# Altium schematic sheet DDR4 Slot.SchDoc
size A3
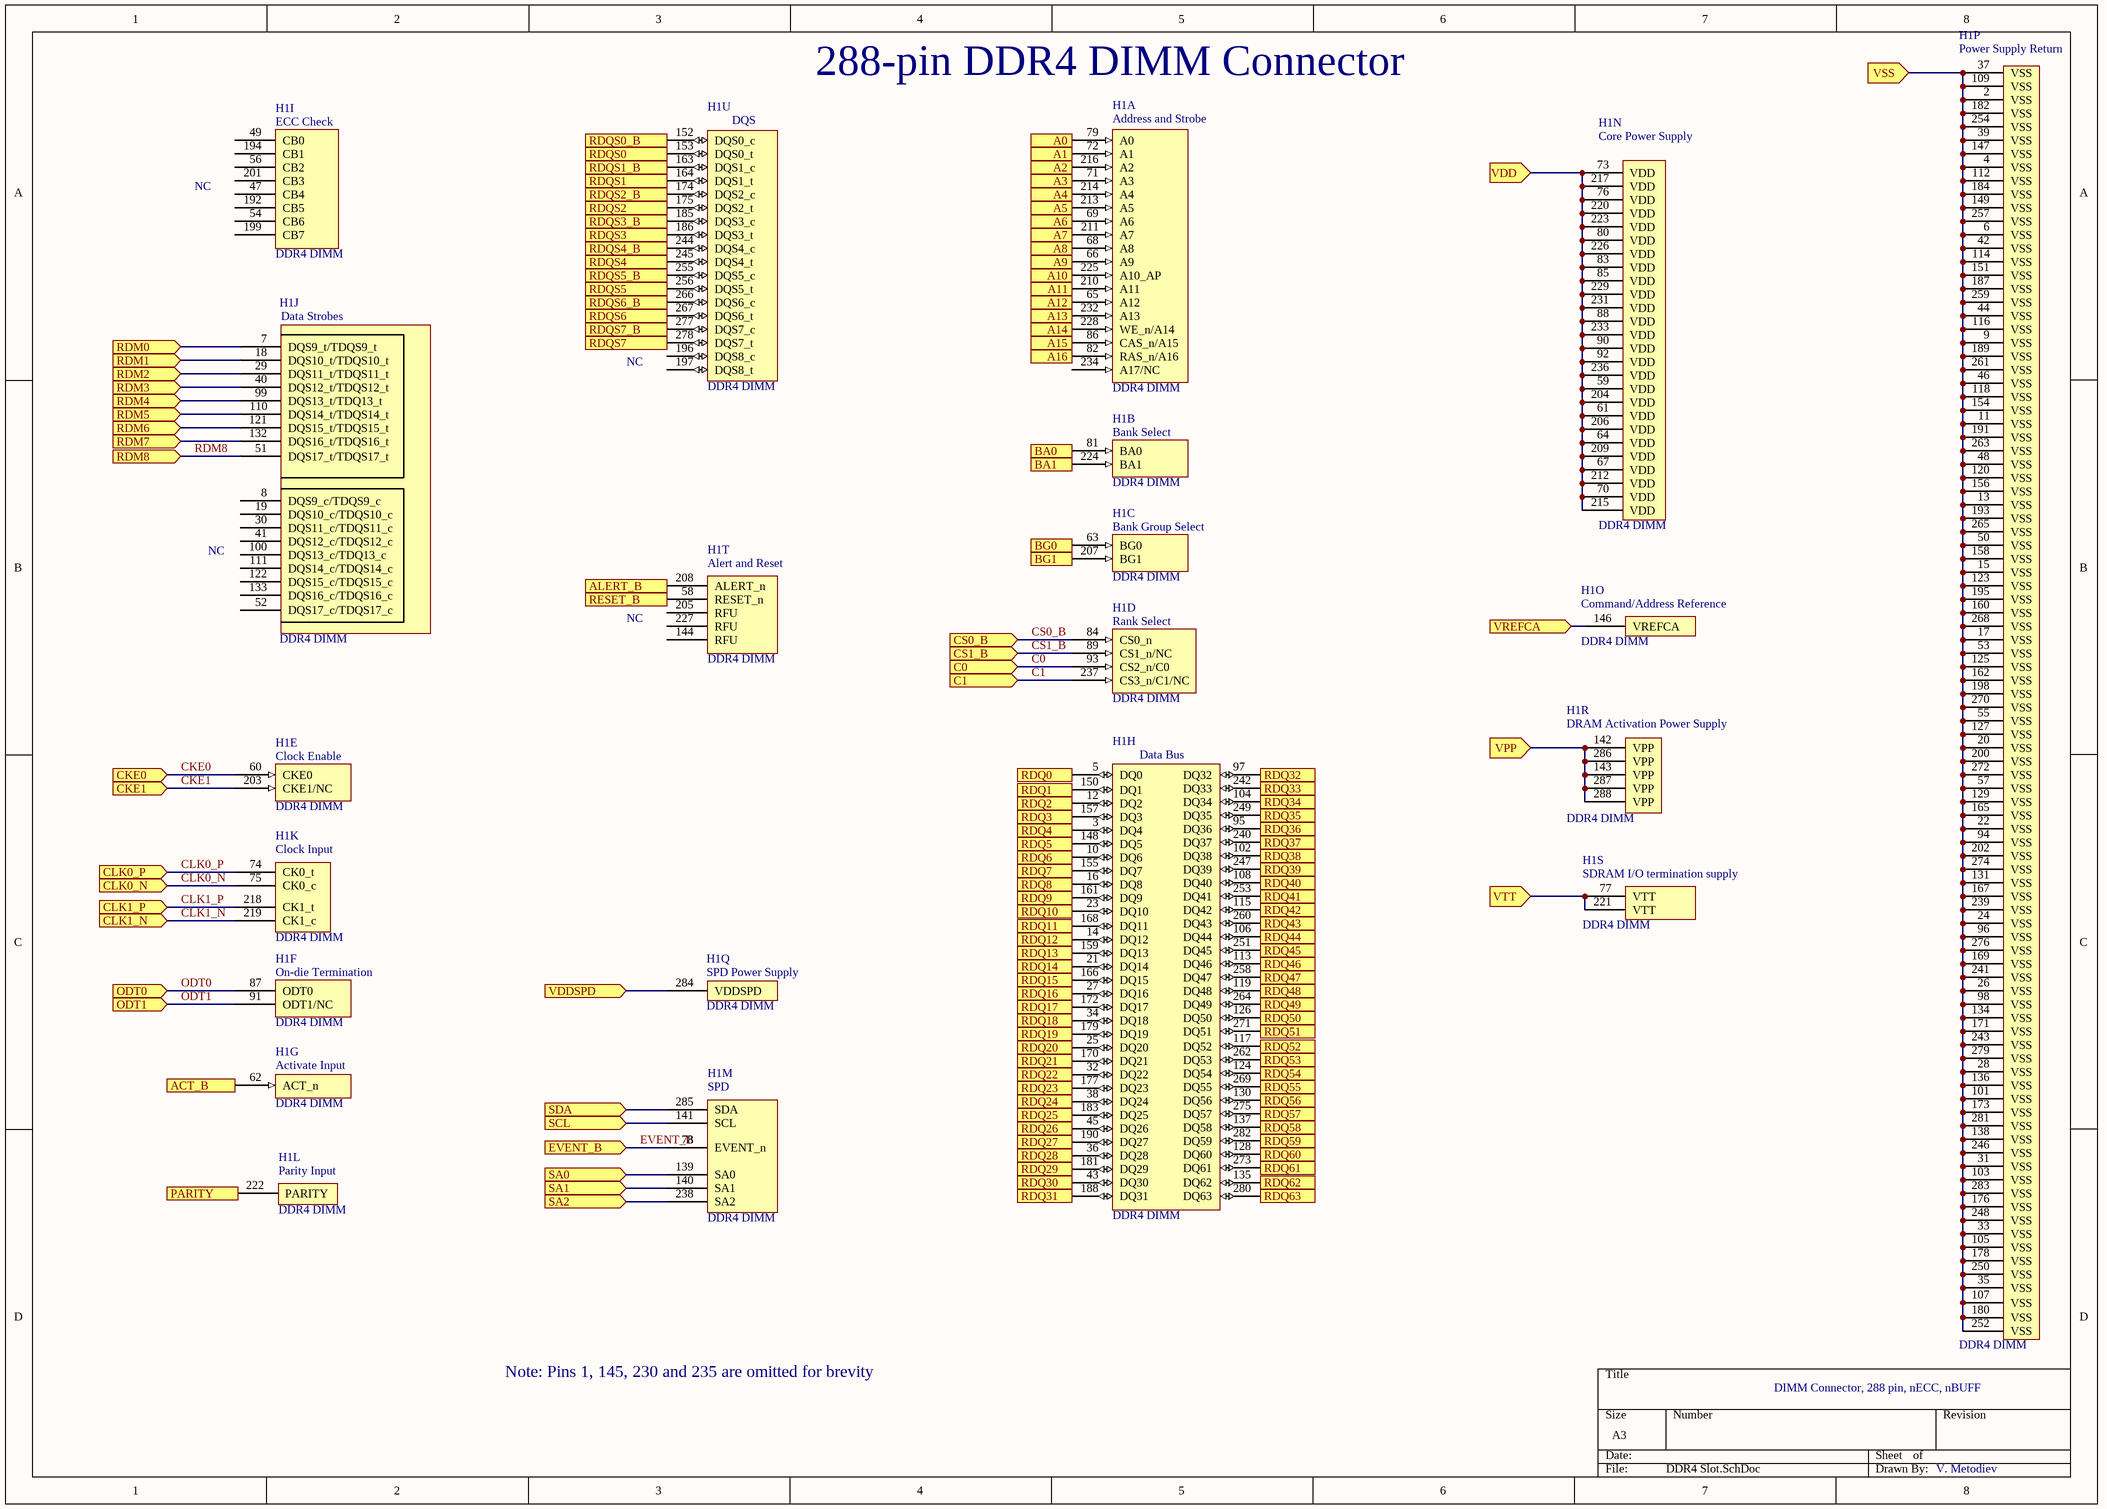
[diagram p0: DDR4 Slot.SchDoc]

## Parts
H1  DDR4 DIMM  [DDR4 DIMM]  (parts A,B,C,D,E,F,G,H,I,J,K,L,M,N,O,P,Q,R,S,T,U of 21)

## Ports
A0 (in), A1 (in), A2 (in), A3 (in), A4 (in), A5 (in), A6 (in), A7 (in), A8 (in), A9 (in), A10 (in), A11 (in), A12 (in), A13 (in), A14 (in), A15 (in), A16 (in), ACT_B (in), ALERT_B (in), BA0 (in), BA1 (in), BG0 (in), BG1 (in), C0 (in), C1 (in), CKE0 (in), CKE1 (in), CLK0_N (in), CLK0_P (in), CLK1_N (in), CLK1_P (in), CS0_B (in), CS1_B (in), EVENT_B (in), ODT0 (in), ODT1 (in), PARITY (in), RDM0 (in), RDM1 (in), RDM2 (in), RDM3 (in), RDM4 (in), RDM5 (in), RDM6 (in), RDM7 (in), RDM8 (in), RDQ0 (in), RDQ1 (in), RDQ2 (in), RDQ3 (in), RDQ4 (in), RDQ5 (in), RDQ6 (in), RDQ7 (in), RDQ8 (in), RDQ9 (in), RDQ10 (in), RDQ11 (in), RDQ12 (in), RDQ13 (in), RDQ14 (in), RDQ15 (in), RDQ16 (in), RDQ17 (in), RDQ18 (in), RDQ19 (in), RDQ20 (in), RDQ21 (in), RDQ22 (in), RDQ23 (in), RDQ24 (in), RDQ25 (in), RDQ26 (in), RDQ27 (in), RDQ28 (in), RDQ29 (in), RDQ30 (in), RDQ31 (in), RDQ32 (in), RDQ33 (in), RDQ34 (in), RDQ35 (in), RDQ36 (in), RDQ37 (in), RDQ38 (in), RDQ39 (in), RDQ40 (in), RDQ41 (in), RDQ42 (in), RDQ43 (in), RDQ44 (in), RDQ45 (in), RDQ46 (in), RDQ47 (in), RDQ48 (in), RDQ49 (in), RDQ50 (in), RDQ51 (in), RDQ52 (in), RDQ53 (in), RDQ54 (in), RDQ55 (in), RDQ56 (in), RDQ57 (in), RDQ58 (in), RDQ59 (in), RDQ60 (in), RDQ61 (in), RDQ62 (in), RDQ63 (in), RDQS0 (in), RDQS0_B (in), RDQS1 (in), RDQS1_B (in), RDQS2 (in), RDQS2_B (in), RDQS3 (in), RDQS3_B (in), RDQS4 (in), RDQS4_B (in), RDQS5 (in), RDQS5_B (in), RDQS6 (in), RDQS6_B (in), RDQS7 (in), RDQS7_B (in), RESET_B (in), SA0 (in), SA1 (in), SA2 (in), SCL (in), SDA (in), VDD (in), VDDSPD (in), VPP (in), VREFCA (in), VSS (in), VTT (in)

## Nets
A0: H1.79(A0) ; port A0
A1: H1.72(A1) ; port A1
A2: H1.216(A2) ; port A2
A3: H1.71(A3) ; port A3
A4: H1.214(A4) ; port A4
A5: H1.213(A5) ; port A5
A6: H1.69(A6) ; port A6
A7: H1.211(A7) ; port A7
A8: H1.68(A8) ; port A8
A9: H1.66(A9) ; port A9
A10: H1.225(A10_AP) ; port A10
A11: H1.210(A11) ; port A11
A12: H1.65(A12) ; port A12
A13: H1.232(A13) ; port A13
A14: H1.228(WE_n/A14) ; port A14
A15: H1.86(CAS_n/A15) ; port A15
A16: H1.82(RAS_n/A16) ; port A16
ACT_B: H1.62(ACT_n) ; port ACT_B
ALERT_B: H1.208(ALERT_n) ; port ALERT_B
BA0: H1.81(BA0) ; port BA0
BA1: H1.224(BA1) ; port BA1
BG0: H1.63(BG0) ; port BG0
BG1: H1.207(BG1) ; port BG1
C0: H1.93(CS2_n/C0) ; port C0
C1: H1.237(CS3_n/C1/NC) ; port C1
CKE0: H1.60(CKE0) ; port CKE0
CKE1: H1.203(CKE1/NC) ; port CKE1
CLK0_N: H1.75(CK0_c) ; port CLK0_N
CLK0_P: H1.74(CK0_t) ; port CLK0_P
CLK1_N: H1.219(CK1_c) ; port CLK1_N
CLK1_P: H1.218(CK1_t) ; port CLK1_P
CS0_B: H1.84(CS0_n) ; port CS0_B
CS1_B: H1.89(CS1_n/NC) ; port CS1_B
EVENT_B: H1.78(EVENT_n) ; port EVENT_B
ODT0: H1.87(ODT0) ; port ODT0
ODT1: H1.91(ODT1/NC) ; port ODT1
PARITY: H1.222(PARITY) ; port PARITY
RDM0: H1.7(DQS9_t/TDQS9_t) ; port RDM0
RDM1: H1.18(DQS10_t/TDQS10_t) ; port RDM1
RDM2: H1.29(DQS11_t/TDQS11_t) ; port RDM2
RDM3: H1.40(DQS12_t/TDQS12_t) ; port RDM3
RDM4: H1.99(DQS13_t/TDQ13_t) ; port RDM4
RDM5: H1.110(DQS14_t/TDQS14_t) ; port RDM5
RDM6: H1.121(DQS15_t/TDQS15_t) ; port RDM6
RDM7: H1.132(DQS16_t/TDQS16_t) ; port RDM7
RDM8: H1.51(DQS17_t/TDQS17_t) ; port RDM8
RDQ0: H1.5(DQ0) ; port RDQ0
RDQ1: H1.150(DQ1) ; port RDQ1
RDQ2: H1.12(DQ2) ; port RDQ2
RDQ3: H1.157(DQ3) ; port RDQ3
RDQ4: H1.3(DQ4) ; port RDQ4
RDQ5: H1.148(DQ5) ; port RDQ5
RDQ6: H1.10(DQ6) ; port RDQ6
RDQ7: H1.155(DQ7) ; port RDQ7
RDQ8: H1.16(DQ8) ; port RDQ8
RDQ9: H1.161(DQ9) ; port RDQ9
RDQ10: H1.23(DQ10) ; port RDQ10
RDQ11: H1.168(DQ11) ; port RDQ11
RDQ12: H1.14(DQ12) ; port RDQ12
RDQ13: H1.159(DQ13) ; port RDQ13
RDQ14: H1.21(DQ14) ; port RDQ14
RDQ15: H1.166(DQ15) ; port RDQ15
RDQ16: H1.27(DQ16) ; port RDQ16
RDQ17: H1.172(DQ17) ; port RDQ17
RDQ18: H1.34(DQ18) ; port RDQ18
RDQ19: H1.179(DQ19) ; port RDQ19
RDQ20: H1.25(DQ20) ; port RDQ20
RDQ21: H1.170(DQ21) ; port RDQ21
RDQ22: H1.32(DQ22) ; port RDQ22
RDQ23: H1.177(DQ23) ; port RDQ23
RDQ24: H1.38(DQ24) ; port RDQ24
RDQ25: H1.183(DQ25) ; port RDQ25
RDQ26: H1.45(DQ26) ; port RDQ26
RDQ27: H1.190(DQ27) ; port RDQ27
RDQ28: H1.36(DQ28) ; port RDQ28
RDQ29: H1.181(DQ29) ; port RDQ29
RDQ30: H1.43(DQ30) ; port RDQ30
RDQ31: H1.188(DQ31) ; port RDQ31
RDQ32: H1.97(DQ32) ; port RDQ32
RDQ33: H1.242(DQ33) ; port RDQ33
RDQ34: H1.104(DQ34) ; port RDQ34
RDQ35: H1.249(DQ35) ; port RDQ35
RDQ36: H1.95(DQ36) ; port RDQ36
RDQ37: H1.240(DQ37) ; port RDQ37
RDQ38: H1.102(DQ38) ; port RDQ38
RDQ39: H1.247(DQ39) ; port RDQ39
RDQ40: H1.108(DQ40) ; port RDQ40
RDQ41: H1.253(DQ41) ; port RDQ41
RDQ42: H1.115(DQ42) ; port RDQ42
RDQ43: H1.260(DQ43) ; port RDQ43
RDQ44: H1.106(DQ44) ; port RDQ44
RDQ45: H1.251(DQ45) ; port RDQ45
RDQ46: H1.113(DQ46) ; port RDQ46
RDQ47: H1.258(DQ47) ; port RDQ47
RDQ48: H1.119(DQ48) ; port RDQ48
RDQ49: H1.264(DQ49) ; port RDQ49
RDQ50: H1.126(DQ50) ; port RDQ50
RDQ51: H1.271(DQ51) ; port RDQ51
RDQ52: H1.117(DQ52) ; port RDQ52
RDQ53: H1.262(DQ53) ; port RDQ53
RDQ54: H1.124(DQ54) ; port RDQ54
RDQ55: H1.269(DQ55) ; port RDQ55
RDQ56: H1.130(DQ56) ; port RDQ56
RDQ57: H1.275(DQ57) ; port RDQ57
RDQ58: H1.137(DQ58) ; port RDQ58
RDQ59: H1.282(DQ59) ; port RDQ59
RDQ60: H1.128(DQ60) ; port RDQ60
RDQ61: H1.273(DQ61) ; port RDQ61
RDQ62: H1.135(DQ62) ; port RDQ62
RDQ63: H1.280(DQ63) ; port RDQ63
RDQS0: H1.153(DQS0_t) ; port RDQS0
RDQS0_B: H1.152(DQS0_c) ; port RDQS0_B
RDQS1: H1.164(DQS1_t) ; port RDQS1
RDQS1_B: H1.163(DQS1_c) ; port RDQS1_B
RDQS2: H1.175(DQS2_t) ; port RDQS2
RDQS2_B: H1.174(DQS2_c) ; port RDQS2_B
RDQS3: H1.186(DQS3_t) ; port RDQS3
RDQS3_B: H1.185(DQS3_c) ; port RDQS3_B
RDQS4: H1.245(DQS4_t) ; port RDQS4
RDQS4_B: H1.244(DQS4_c) ; port RDQS4_B
RDQS5: H1.256(DQS5_t) ; port RDQS5
RDQS5_B: H1.255(DQS5_c) ; port RDQS5_B
RDQS6: H1.267(DQS6_t) ; port RDQS6
RDQS6_B: H1.266(DQS6_c) ; port RDQS6_B
RDQS7: H1.278(DQS7_t) ; port RDQS7
RDQS7_B: H1.277(DQS7_c) ; port RDQS7_B
RESET_B: H1.58(RESET_n) ; port RESET_B
SA0: H1.139(SA0) ; port SA0
SA1: H1.140(SA1) ; port SA1
SA2: H1.238(SA2) ; port SA2
SCL: H1.141(SCL) ; port SCL
SDA: H1.285(SDA) ; port SDA
VDD: H1.59(VDD) H1.61(VDD) H1.64(VDD) H1.67(VDD) H1.70(VDD) H1.73(VDD) H1.76(VDD) H1.80(VDD) H1.83(VDD) H1.85(VDD) H1.88(VDD) H1.90(VDD) H1.92(VDD) H1.204(VDD) H1.206(VDD) H1.209(VDD) H1.212(VDD) H1.215(VDD) H1.217(VDD) H1.220(VDD) H1.223(VDD) H1.226(VDD) H1.229(VDD) H1.231(VDD) H1.233(VDD) H1.236(VDD) ; port VDD
VDDSPD: H1.284(VDDSPD) ; port VDDSPD
VPP: H1.142(VPP) H1.143(VPP) H1.286(VPP) H1.287(VPP) H1.288(VPP) ; port VPP
VREFCA: H1.146(VREFCA) ; port VREFCA
VSS: H1.2(VSS) H1.4(VSS) H1.6(VSS) H1.9(VSS) H1.11(VSS) H1.13(VSS) H1.15(VSS) H1.17(VSS) H1.20(VSS) H1.22(VSS) H1.24(VSS) H1.26(VSS) H1.28(VSS) H1.31(VSS) H1.33(VSS) H1.35(VSS) H1.37(VSS) H1.39(VSS) H1.42(VSS) H1.44(VSS) H1.46(VSS) H1.48(VSS) H1.50(VSS) H1.53(VSS) H1.55(VSS) H1.57(VSS) H1.94(VSS) H1.96(VSS) H1.98(VSS) H1.101(VSS) H1.103(VSS) H1.105(VSS) H1.107(VSS) H1.109(VSS) H1.112(VSS) H1.114(VSS) H1.116(VSS) H1.118(VSS) H1.120(VSS) H1.123(VSS) H1.125(VSS) H1.127(VSS) H1.129(VSS) H1.131(VSS) H1.134(VSS) H1.136(VSS) H1.138(VSS) H1.147(VSS) H1.149(VSS) H1.151(VSS) H1.154(VSS) H1.156(VSS) H1.158(VSS) H1.160(VSS) H1.162(VSS) H1.165(VSS) H1.167(VSS) H1.169(VSS) H1.171(VSS) H1.173(VSS) H1.176(VSS) H1.178(VSS) H1.180(VSS) H1.182(VSS) H1.184(VSS) H1.187(VSS) H1.189(VSS) H1.191(VSS) H1.193(VSS) H1.195(VSS) H1.198(VSS) H1.200(VSS) H1.202(VSS) H1.239(VSS) H1.241(VSS) H1.243(VSS) H1.246(VSS) H1.248(VSS) H1.250(VSS) H1.252(VSS) H1.254(VSS) H1.257(VSS) H1.259(VSS) H1.261(VSS) H1.263(VSS) H1.265(VSS) H1.268(VSS) H1.270(VSS) H1.272(VSS) H1.274(VSS) H1.276(VSS) H1.279(VSS) H1.281(VSS) H1.283(VSS) ; port VSS
VTT: H1.77(VTT) H1.221(VTT) ; port VTT

Not connected (* = marked no-connect by the designer): H1 8(DQS9_c/TDQS9_c) 19(DQS10_c/TDQS10_c) 30(DQS11_c/TDQS11_c) 41(DQS12_c/TDQS12_c) 47(CB4) 49(CB0) 52(DQS17_c/TDQS17_c) 54(CB6) 56(CB2) 100(DQS13_c/TDQ13_c) 111(DQS14_c/TDQS14_c) 122(DQS15_c/TDQS15_c) 133(DQS16_c/TDQS16_c) 144(RFU) 192(CB5) 194(CB1) 196(DQS8_c) 197(DQS8_t) 199(CB7) 201(CB3) 205(RFU) 227(RFU) 234(A17/NC)

## Notes on the sheet
- 288-pin DDR4 DIMM Connector
- NC
- Note: Pins 1, 145, 230 and 235 are omitted for brevity
- (near H1) DIMM Connector, 288 pin, nECC, nBUFF
- V. Metodiev
- (in symbol DDR4 DIMM, part A) Address and Strobe
- (in symbol DDR4 DIMM, part B) Bank Select
- (in symbol DDR4 DIMM, part C) Bank Group Select
- (in symbol DDR4 DIMM, part D) Rank Select
- (in symbol DDR4 DIMM, part E) Clock Enable
- (in symbol DDR4 DIMM, part F) On-die Termination
- (in symbol DDR4 DIMM, part G) Activate Input
- (in symbol DDR4 DIMM, part H) Data Bus
- (in symbol DDR4 DIMM, part I) ECC Check
- (in symbol DDR4 DIMM, part J) Data Strobes
- (in symbol DDR4 DIMM, part K) Clock Input
- (in symbol DDR4 DIMM, part L) Parity Input
- (in symbol DDR4 DIMM, part M) SPD
- (in symbol DDR4 DIMM, part N) Core Power Supply
- (in symbol DDR4 DIMM, part O) Command/Address Reference
- (in symbol DDR4 DIMM, part P) Power Supply Return
- (in symbol DDR4 DIMM, part Q) SPD Power Supply
- (in symbol DDR4 DIMM, part R) DRAM Activation Power Supply
- (in symbol DDR4 DIMM, part S) SDRAM I/O termination supply
- (in symbol DDR4 DIMM, part T) Alert and Reset
- (in symbol DDR4 DIMM, part U) DQS